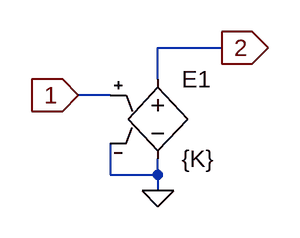
[diagram p0: schematic GainBlock.asc]
GainBlock.asc, the LTspice schematic file:
Version 4
SHEET 1 880 680
WIRE 64 192 32 192
WIRE 112 176 112 144
WIRE 112 144 176 144
WIRE 64 240 64 272
WIRE 64 272 112 272
WIRE 112 272 112 256
WIRE 112 272 112 288
FLAG 112 288 0
FLAG 32 192 1
IOPIN 32 192 In
FLAG 176 144 2
IOPIN 176 144 Out
SYMBOL e 112 160 R0
SYMATTR InstName E1
SYMATTR Value {K}

The netlist it stands for:
* GainBlock.asc
E1 2 0 1 0 {K}
.backanno
.end